# Altium schematic sheet P14 FLASH & TF & GSENSO.SchDoc
size 420 x 297 mm
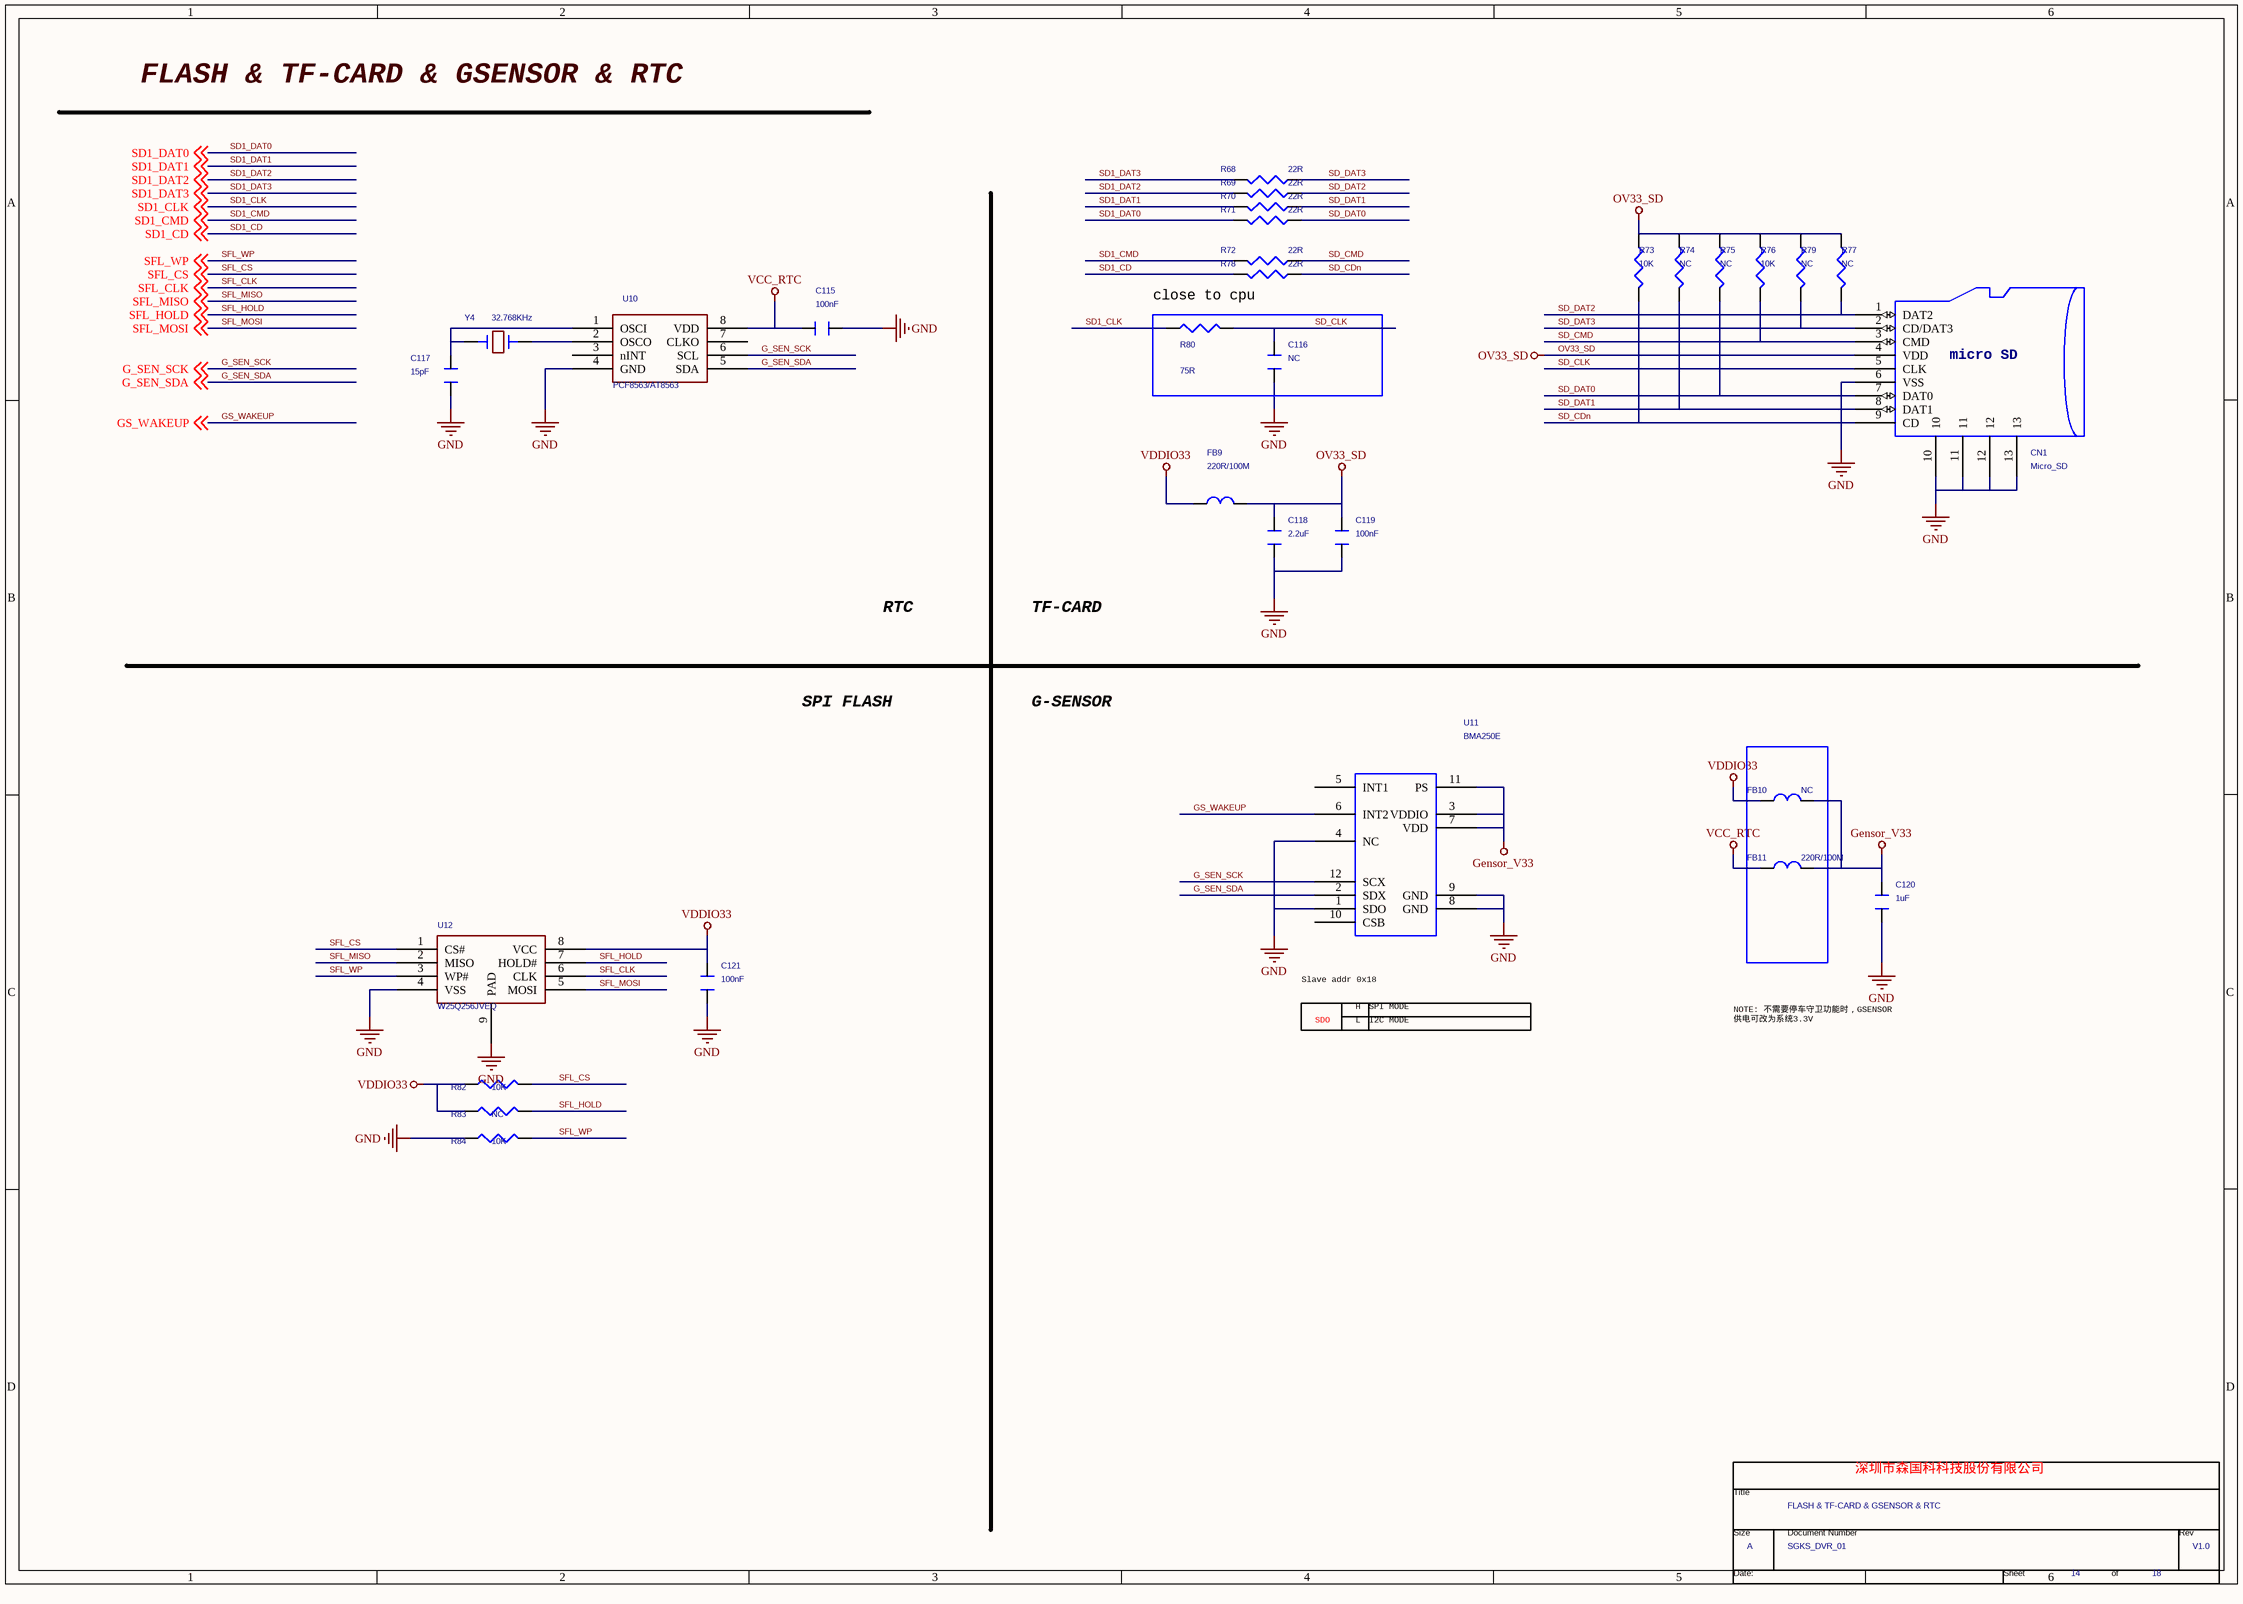
[diagram p0: P14 FLASH & TF & GSENSO.SchDoc]

## Parts
*  Page Count: 18  Page Number: 14  Page Size: A  Title: FLASH & TF-CARD & GSENSOR & RTC  RevCode: V1.0  Doc: SGKS_DVR_01  (hidden comment: TitleBlock0)  (graphical)
C115  100nF  [C0402]
C116  NC  [C0402]
C117  15pF  [C0402]
C118  2.2uF  [C0402]
C119  100nF  [C0402]
C120  1uF  [C0402]
C121  100nF  [C0402]
CN1  Micro_SD  [MicroSD]
FB9  220R/100M  [0805]
FB10  NC  [0805]
FB11  220R/100M  [0805]
R68  22R  [R0603/SMD]
R69  22R  [R0603/SMD]
R70  22R  [R0603/SMD]
R71  22R  [R0603/SMD]
R72  22R  [R0603/SMD]
R73  10K  [R0603/SMD]
R74  NC  [R0603/SMD]
R75  NC  [R0603/SMD]
R76  10K  [R0603/SMD]
R77  NC  [R0603/SMD]
R78  22R  [R0603/SMD]
R79  NC  [R0603/SMD]
R80  75R  [R0603/SMD]
R82  10K  [R0402]
R83  NC  [R0402]
R84  10K  [R0402]
U10  PCF8563/AT8563  [SO-8]
U11  BMA250E  [LGA12/1.8X1.8]
U12  W25Q256JVEQ  [SOIC-8]
Y4  32.768KHz  [SMD/CRY]

## Blocks framed on the sheet
close to cpu: C116 R80

## Nets
Gensor_V33: C120.1 FB10.2 FB11.2 U11.3(VDDIO) U11.7(VDD) U11.11(PS)
GND: C115.2 C116.1 C117.2 C118.1 C119.1 C120.2 C121.2 CN1.6(VSS) CN1.10 CN1.11 CN1.12 CN1.13 R84.1 U10.4(GND) U11.1(SDO) U11.4(NC) U11.8(GND) U11.9(GND) U12.4(VSS) U12.9(PAD)
OV33_SD: C118.2 C119.2 CN1.4(VDD) FB9.2 R73.1 R74.1 R75.1 R76.1 R77.1 R79.1
VCC_RTC: C115.1 FB11.1 U10.8(VDD)
VDDIO33: C121.1 FB9.1 FB10.1 R82.1 R83.1 U12.8(VCC)
G_SEN_SCK: U10.6(SCL) U11.12(SCX) ; off-sheet G_SEN_SCK
G_SEN_SDA: U10.5(SDA) U11.2(SDX) ; off-sheet G_SEN_SDA
GS_WAKEUP: U11.6(INT2) ; off-sheet GS_WAKEUP
SD1_CD: R78.2 ; off-sheet SD1_CD
SD1_CLK: R80.2 ; off-sheet SD1_CLK
SD1_CMD: R72.2 ; off-sheet SD1_CMD
SD1_DAT0: R71.2 ; off-sheet SD1_DAT0
SD1_DAT1: R70.2 ; off-sheet SD1_DAT1
SD1_DAT2: R69.2 ; off-sheet SD1_DAT2
SD1_DAT3: R68.2 ; off-sheet SD1_DAT3
SD_CDn: CN1.9(CD) R73.2 R78.1
SD_CLK: C116.2 CN1.5(CLK) R80.1
SD_CMD: CN1.3(CMD) R72.1 R76.2
SD_DAT0: CN1.7(DAT0) R71.1 R75.2
SD_DAT1: CN1.8(DAT1) R70.1 R74.2
SD_DAT2: CN1.1(DAT2) R69.1 R77.2
SD_DAT3: CN1.2(CD/DAT3) R68.1 R79.2
SFL_CLK: U12.6(CLK) ; off-sheet SFL_CLK
SFL_CS: R82.2 U12.1(CS#) ; off-sheet SFL_CS
SFL_HOLD: R83.2 U12.7(HOLD#) ; off-sheet SFL_HOLD
SFL_MISO: U12.2(MISO) ; off-sheet SFL_MISO
SFL_MOSI: U12.5(MOSI) ; off-sheet SFL_MOSI
SFL_WP: R84.2 U12.3(WP#) ; off-sheet SFL_WP
NetC117_1: C117.1 U10.1(OSCI) Y4.2
NetU10_2: U10.2(OSCO) Y4.1

Not connected (* = marked no-connect by the designer): U10 3(nINT) 7(CLKO); U11 5(INT1) 10(CSB)

## Notes on the sheet
- FLASH & TF-CARD & GSENSOR & RTC
- RTC
- TF-CARD
- SPI FLASH
- G-SENSOR
- Slave addr 0x18
- NOTE: 不需要停车守卫功能时，GSENSOR
  供电可改为系统3.3V
- SDO
- H
- L
- SPI MODE
- I2C MODE
- 深圳市森国科科技股份有限公司
- (in symbol SD/MICRO) micro SD
- (in symbol TitleBlock0) Title; Size; Document Number; Rev; Date:; Sheet; of

## Library data of the parts
C115 C117 = CAPACITOR: PAGE: 1
C116 C118-C121 = CAPACITOR_0_Dup3
CN1 = SD/MICRO: Type: 贴片插座
FB9-FB11 = Ferrite BEAD
R68-R80 = RES/SMD_0: Part Description: Chip Resistor
R82 = ?_0: 备注: YCL0465; 元件编号: 电阻; 元件类别: 电阻100K,±5%,1/16W,0402 每盘10K; 规格型号: 原材料; Vendor: R0402
R83 R84 = ?_0: 规格型号: 原材料; 元件类别: 电阻100K,±5%,1/16W,0402 每盘10K; 元件编号: 电阻; 备注: YCL0465; Vendor: R0402
U10 = PCF8563
U11 = GSENSOR/BMA250E_1: Part Description: IC; Type: IC
U12 = SPI-NOR-SO8_0
Y4 = CRYSTAL_2: Type: 贴片晶振
* = TitleBlock0: Page Create Date: March  8, 1995